# EAGLE design flexibleConnector (EAGLE 6.5.0)
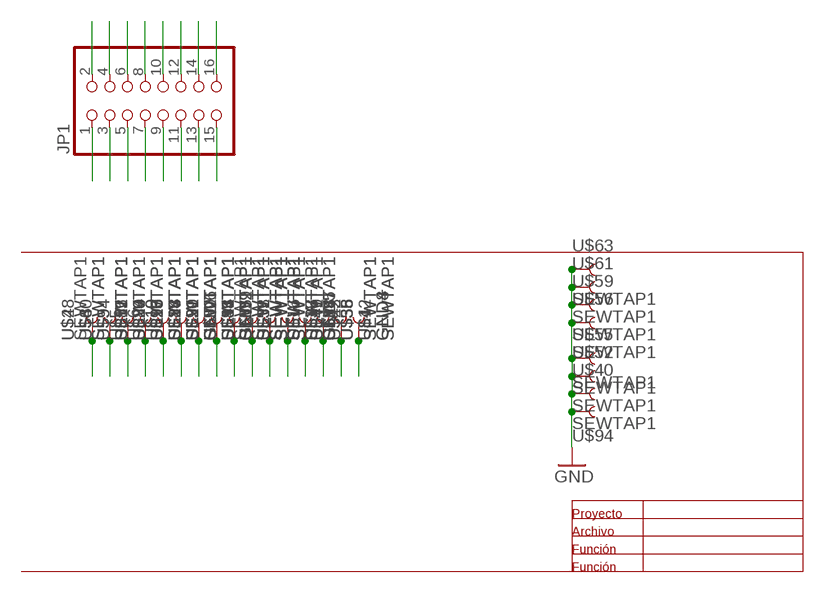
[diagram p0: schematic, sheet 1]

## Parts
GND1  SEWTAP1  [PETAL-LONG-1]
GND2  SEWTAP1  [PETAL-LONG-1]
GND4  SEWTAP1  [PETAL-LONG-1]
GND5  SEWTAP1  [PETAL-LONG-1]
GND6  SEWTAP1  [PETAL-LONG-1]
GND7  SEWTAP1  [PETAL-LONG-1]
GND8  SEWTAP1  [PETAL-LONG-1]
GND9  SEWTAP1  [PETAL-LONG-1]
JP1  PINHD-2X8  [2X08]
U$1  SEWTAP1  [PETAL-LONG-1]
U$2  SEWTAP1  [PETAL-LONG-1]
U$3  SEWTAP1  [PETAL-LONG-1]
U$4  SEWTAP1  [PETAL-LONG-1]
U$5  SEWTAP1  [PETAL-LONG-1]
U$6  SEWTAP1  [PETAL-LONG-1]
U$7  SEWTAP1  [PETAL-LONG-1]
U$8  SEWTAP1  [PETAL-LONG-1]
U$9  SEWTAP1  [PETAL-LONG-1]
U$10  SEWTAP1  [PETAL-LONG-1]
U$11  SEWTAP1  [PETAL-LONG-1]
U$12  SEWTAP1  [PETAL-LONG-1]
U$13  SEWTAP1  [PETAL-LONG-1]
U$14  SEWTAP1  [PETAL-LONG-1]
U$15  SEWTAP1  [PETAL-LONG-1]
U$16  SEWTAP1  [PETAL-LONG-1]
U$17  SEWTAP1  [PETAL-LONG-1]
U$18  SEWTAP1  [PETAL-LONG-1]
U$19  SEWTAP1  [PETAL-LONG-1]
U$20  SEWTAP1  [PETAL-LONG-1]
U$21  SEWTAP1  [PETAL-LONG-1]
U$22  SEWTAP1  [PETAL-LONG-1]
U$23  SEWTAP1  [PETAL-LONG-1]
U$24  SEWTAP1  [PETAL-LONG-1]
U$25  SEWTAP1  [PETAL-LONG-1]
U$26  SEWTAP1  [PETAL-LONG-1]
U$27  SEWTAP1  [PETAL-LONG-1]
U$28  SEWTAP1  [PETAL-LONG-1]
U$29  SEWTAP1  [PETAL-LONG-1]
U$30  SEWTAP1  [PETAL-LONG-1]
U$31  SEWTAP1  [PETAL-LONG-1]
U$32  SEWTAP1  [PETAL-LONG-1]
U$33  SEWTAP1  [PETAL-LONG-1]
U$34  SEWTAP1  [PETAL-LONG-1]
U$35  SEWTAP1  [PETAL-LONG-1]
U$36  SEWTAP1  [PETAL-LONG-1]
U$38  SEWTAP1  [PETAL-LONG-1]
U$40  SEWTAP1  [PETAL-LONG-1]
U$41  SEWTAP1  [PETAL-LONG-1]
U$42  SEWTAP1  [PETAL-LONG-1]
U$43  SEWTAP1  [PETAL-LONG-1]
U$44  SEWTAP1  [PETAL-LONG-1]
U$48  SEWTAP1  [PETAL-LONG-1]
U$49  SEWTAP1  [PETAL-LONG-1]
U$50  SEWTAP1  [PETAL-LONG-1]
U$52  SEWTAP1  [PETAL-LONG-1]
U$53  SEWTAP1  [PETAL-LONG-1]
U$54  SEWTAP1  [PETAL-LONG-1]
U$55  SEWTAP1  [PETAL-LONG-1]
U$56  SEWTAP1  [PETAL-LONG-1]
U$58  SEWTAP1  [PETAL-LONG-1]
U$59  SEWTAP1  [PETAL-LONG-1]
U$60  SEWTAP1  [PETAL-LONG-1]
U$61  SEWTAP1  [PETAL-LONG-1]
U$63  SEWTAP1  [PETAL-LONG-1]
U$65  SEWTAP1  [PETAL-LONG-1]
U$85  SEWTAP1  [PETAL-LONG-1]
U$88  SEWTAP1  [PETAL-LONG-1]
U$89  SEWTAP1  [PETAL-LONG-1]
U$90  SEWTAP1  [PETAL-LONG-1]
U$91  SEWTAP1  [PETAL-LONG-1]
U$92  SEWTAP1  [PETAL-LONG-1]
U$93  SEWTAP1  [PETAL-LONG-1]
U$94  SEWTAP1  [PETAL-LONG-1]

## Nets
1: GND4.1 GND8.1 JP1.1 U$22.1 U$43.1
2: JP1.2 U$1.1 U$41.1 U$42.1 U$49.1
3: JP1.3 U$35.1 U$36.1 U$38.1 U$58.1
4: GND5.1 GND7.1 JP1.4 U$18.1 U$34.1
5: JP1.5 U$17.1 U$32.1 U$33.1 U$53.1
6: GND2.1 GND9.1 JP1.6 U$16.1 U$65.1
7: JP1.7 U$15.1 U$31.1 U$44.1 U$93.1
8: GND1.1 GND6.1 JP1.8 U$50.1 U$92.1
9: JP1.9 U$21.1 U$29.1 U$30.1 U$91.1
10: JP1.10 U$14.1 U$27.1 U$28.1 U$88.1
11: JP1.11 U$13.1 U$25.1 U$26.1 U$90.1
12: JP1.12 U$20.1 U$23.1 U$24.1 U$89.1
13: JP1.13 U$7.1 U$11.1 U$12.1 U$85.1
14: JP1.14 U$9.1 U$10.1 U$19.1 U$54.1
15: JP1.15 U$4.1 U$6.1 U$8.1 U$60.1
16: JP1.16 U$2.1 U$3.1 U$5.1 U$48.1
GND: U$40.1 U$52.1 U$55.1 U$56.1 U$59.1 U$61.1 U$63.1 U$94.1

## Notes on the sheet
- Proyecto
- Archivo
- Función
- Función

## Library data of the parts
GND1 GND2 GND4-GND9 U$1-U$36 U$38 U$40-U$44 U$48-U$50 U$52-U$56 U$58-U$61 U$63 U$65 U$85 U$88-U$94 = LilyPad-Wearables:SEWTAP: Sew Taps for LilyPad Boards.
JP1 = pinhead+:PINHD-2X8: PIN HEADER

## Net classes
0 Default: width 0.203 mm
1 VCC: width 0.305 mm

## Board
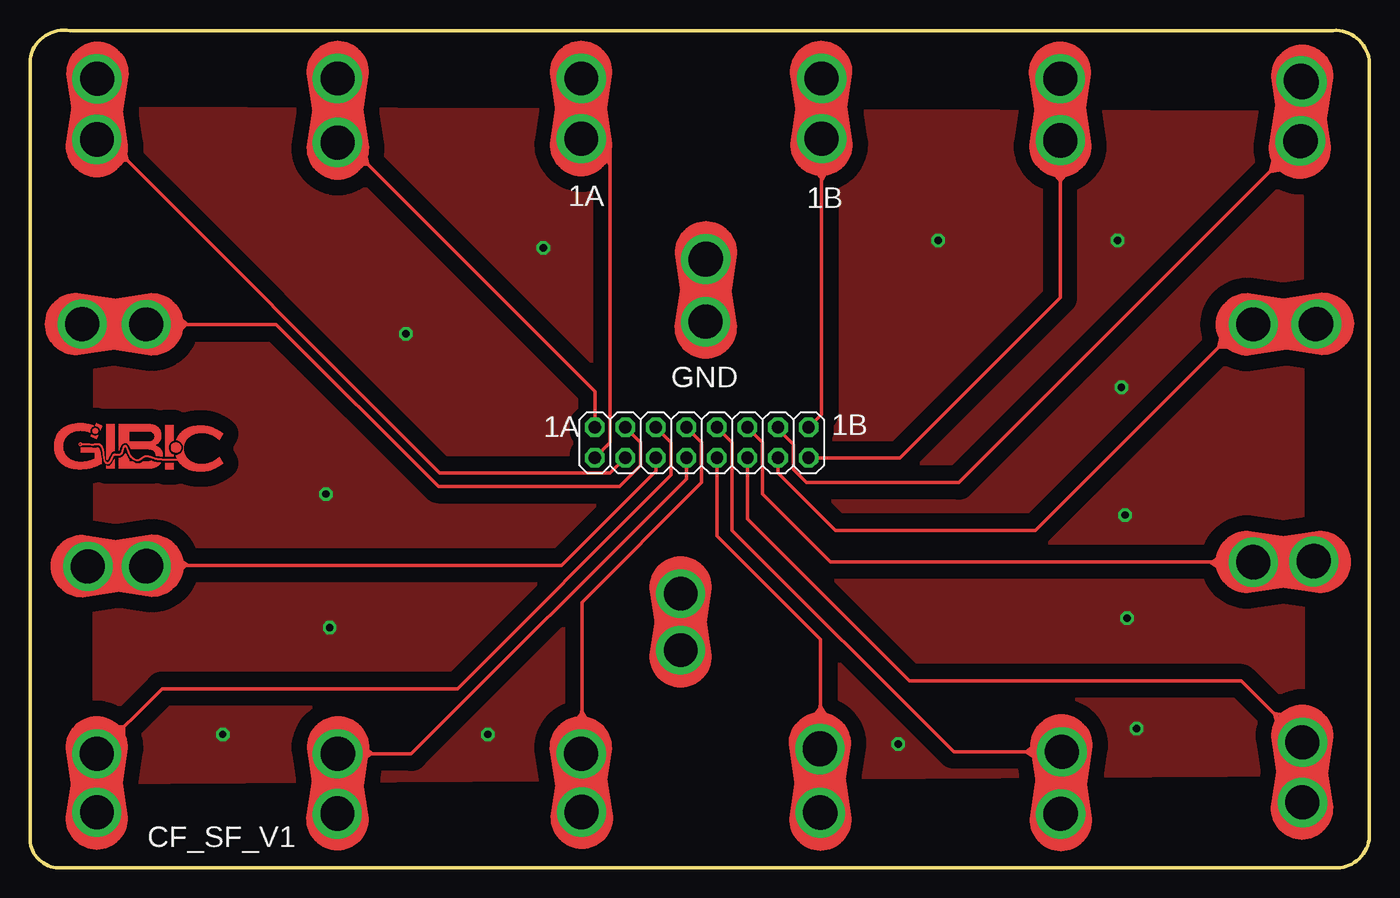
[diagram p1: board, top side]
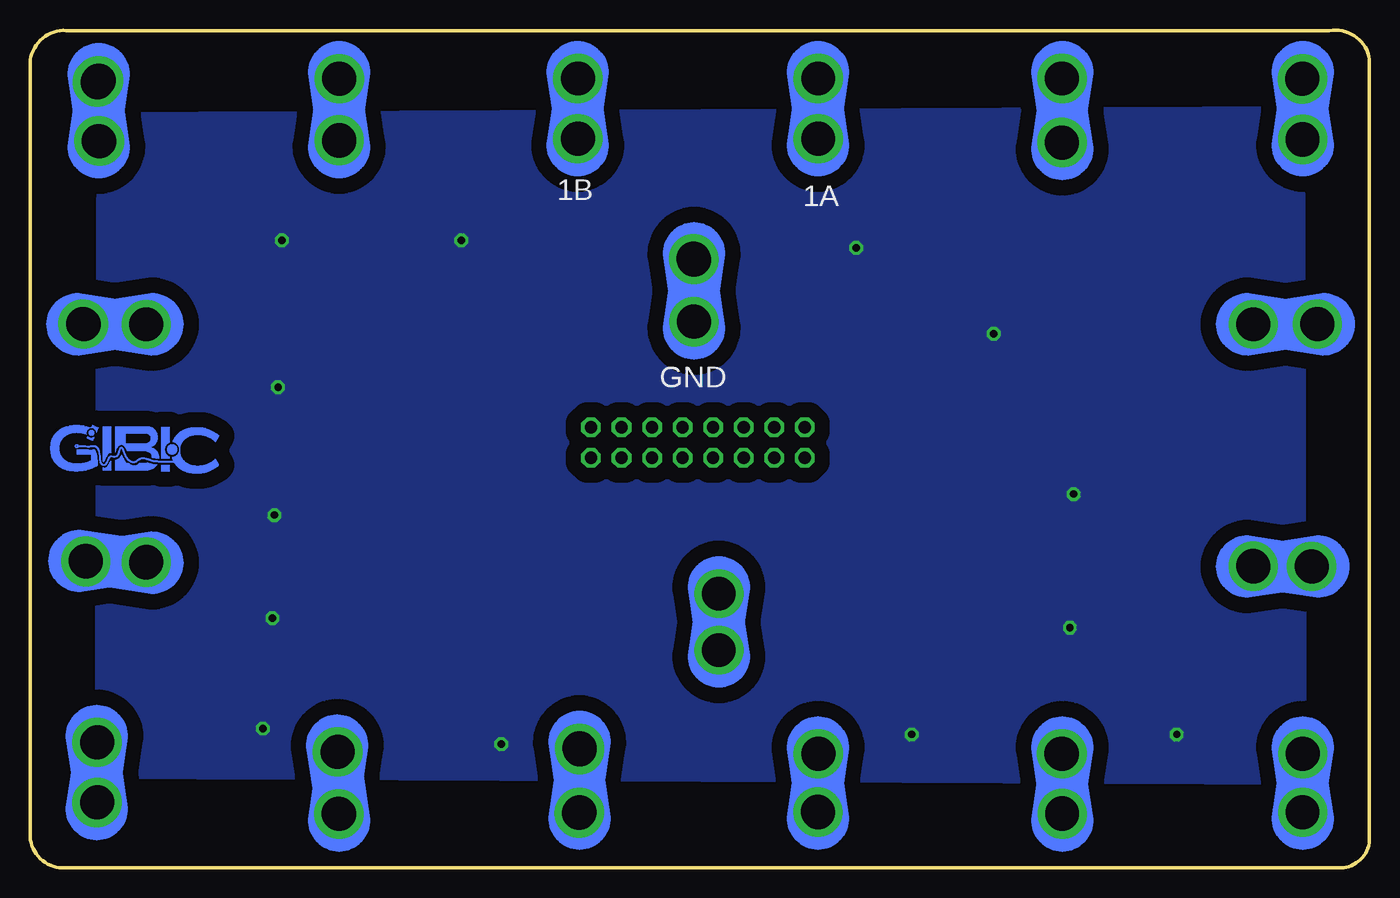
[diagram p2: board, bottom side, seen from below]

Size 111.44 x 69.73 mm. Coordinates in mm from the lower left corner, seen from the top.
Outline: 3.33,69.69 108.43,69.69 arc-90 111.44,66.99 111.44,2.86 arc-90 108.74,0 2.38,0 arc-90 0,2.54 0,67.31 arc-90 3.33,69.69
Copper layers (1*16): Top 0.35mm / dielectric 1.5mm / Bottom 0.35mm
Design rules "SparkFun *": minimum track width 8mil, minimum drill 20mil, track to track 8mil, track to pad 8mil, pad to pad 8mil, via to via 8mil, smd to smd 8mil, copper to edge 10mil, drill to drill 8mil, minimum pad ring 12mil, minimum via ring 10mil, stop-mask expansion 4mil, vias tented up to drill 20mil, thermal gap 20mil

### Footprints (pad centres in the part's own frame; a part is rotated, then mirrored left to right if it is on the bottom)
PETAL-LONG-1 = drill 2.794 pad 4.064: 1 0.03,0
2X08 = drill 1.016 octagon: 1 -8.89,-1.27; 2 -8.89,1.27; 3 -6.35,-1.27; 4 -6.35,1.27; 5 -3.81,-1.27; 6 -3.81,1.27; 7 -1.27,-1.27; 8 -1.27,1.27; 9 1.27,-1.27; 10 1.27,1.27; 11 3.81,-1.27; 12 3.81,1.27; 13 6.35,-1.27; 14 6.35,1.27; 15 8.89,-1.27; 16 8.89,1.27

### Placement (x,y rotation side)
GND1  45.82,9.55 270 top
GND2  5.56,9.53 270 bottom
GND4  45.85,60.66 90 top
GND5  4.31,45.27 0 top
GND6  45.88,9.53 270 bottom
GND7  4.29,45.24 180 bottom
GND8  45.88,65.72 270 bottom
GND9  5.56,4.6 90 bottom
JP1  55.88,35.4 0 top
U$1  25.6,65.74 270 top
U$2  65.88,65.72 270 bottom
U$3  65.88,60.64 90 bottom
U$4  85.73,60.48 90 bottom
U$5  65.82,65.74 270 top
U$6  85.7,65.69 270 top
U$7  101.74,45.24 0 top
U$8  85.73,65.72 270 bottom
U$9  105.73,60.48 90 bottom
U$10  105.73,65.56 270 bottom
U$11  107,45.24 0 bottom
U$12  101.76,45.24 180 bottom
U$13  105.85,10.5 270 top
U$14  85.82,9.7 270 top
U$15  25.63,9.55 270 top
U$16  5.55,9.54 270 top
U$17  9.71,25.16 180 top
U$18  9.69,45.24 180 top
U$19  105.84,65.42 270 top
U$20  101.74,25.47 0 top
U$21  65.71,9.87 270 top
U$22  45.85,65.74 270 top
U$23  106.84,25.56 0 bottom
U$24  101.76,25.4 180 bottom
U$25  105.89,5.4 90 bottom
U$26  105.89,10.48 270 bottom
U$27  85.73,4.45 90 bottom
U$28  85.88,9.68 270 bottom
U$29  65.72,10 270 bottom
U$30  65.72,4.6 90 bottom
U$31  25.56,4.45 90 bottom
U$32  4.76,25.08 180 bottom
U$33  9.68,25.08 0 bottom
U$34  9.68,45.24 0 bottom
U$35  5.56,65.72 270 bottom
U$36  5.56,60.64 90 bottom
U$38  5.61,65.68 270 top
U$40  56.24,50.74 270 top
U$41  25.56,65.72 270 bottom
U$42  25.56,60.33 90 bottom
U$43  45.88,60.64 90 bottom
U$44  25.56,9.53 270 bottom
U$48  65.85,60.68 90 top
U$49  25.61,60.36 90 top
U$50  45.88,4.6 90 bottom
U$52  56.2,50.64 270 bottom
U$53  4.79,25.12 0 top
U$54  105.66,60.43 90 top
U$55  56.2,45.4 90 bottom
U$56  54.13,22.86 270 top
U$58  5.56,60.57 90 top
U$59  54.13,18.1 90 top
U$60  85.72,60.57 90 top
U$61  54.13,18.1 90 bottom
U$63  54.13,22.86 270 bottom
U$65  5.56,4.61 90 top
U$85  107.08,45.28 180 top
U$88  85.77,4.48 90 top
U$89  106.82,25.47 180 top
U$90  105.83,5.44 90 top
U$91  65.76,4.53 90 top
U$92  45.91,4.66 90 top
U$93  25.57,4.54 90 top
U$94  56.22,45.45 90 top

### Tracks (layer width: path | path; a pad name or v marks a point on that pad's centre or on a via)
1
  Top 0.305: GND4.1 U$22.1 46.2,66.06 | GND4.1 | GND4.1 48.26,60.69 48.26,58.58 | 48.26,58.58 48.26,35.4 JP1.1 | 48.26,58.58 47.78,59.37
  Bottom 0.61: U$22.1 45.87,65.69 GND8.1 | U$43.1 45.87,60.69 GND4.1
2
  Top 0.305: U$1.1 25.56,65.76 | JP1.2 46.99,39.64 26.25,60.39 U$49.1
  Top 0.406: U$1.1 U$49.1
  Bottom 0.61: U$41.1 25.58,65.71 U$1.1 | U$49.1 25.58,60.35 U$42.1
3
  Top 0.305: U$38.1 5.24,66.01 | JP1.3 48.26,32.86 34.09,32.86 6.28,60.67 U$36.1
  Top 0.406: U$38.1 5.56,65.65 U$58.1
  Bottom 0.61: U$36.1 5.56,60.83 U$58.1 | U$35.1 U$38.1
4
  Top 0.305: JP1.4 50.8,35.4 50.8,33.5 49.05,31.75 33.97,31.75 20.48,45.24 U$18.1 9.63,45.27 GND5.1
  Bottom 0.61: GND7.1 GND5.1 | U$34.1 U$18.1
5
  Top 0.305: JP1.5 52.07,33.02 44.21,25.16 U$17.1 | U$53.1 9.64,25.12
  Top 0.406: U$17.1 9.64,25.12
  Top 0.61: U$53.1 U$32.1 | 9.64,25.12 9.65,25.1 U$33.1
6
  Top 0.305: JP1.6 53.34,35.4 53.34,32.7 35.56,14.92 10.98,14.92 GND2.1
  Top 0.406: U$16.1 GND2.1 U$65.1
  Top 0.61: GND2.1 U$16.1 | U$65.1 GND9.1
7
  Top 0.305: JP1.7 54.61,32.38 31.72,9.49 U$44.1
  Top 0.406: U$15.1 25.57,9.47 U$93.1
  Top 0.61: U$44.1 25.59,9.52 U$15.1 | U$93.1 25.56,4.55 U$31.1
8
  Top 0.305: JP1.8 55.88,35.4 55.88,32.07 45.91,22.1 45.91,8.89
  Top 0.406: GND1.1 45.91,9.43 45.91,8.89 U$92.1
  Top 0.61: GND1.1 45.85,9.49 GND6.1 | U$92.1 45.88,4.66 U$50.1
9
  Top 0.305: U$91.1 66.67,3.65 66.04,3.01 | JP1.9 57.15,27.62 65.76,19.01 65.76,9.79
  Top 0.406: U$21.1 65.76,9.79 65.76,9.21 U$91.1
  Top 0.61: U$21.1 65.72,9.86 U$29.1 | U$30.1 65.76,4.59 U$91.1
10
  Top 0.305: U$14.1 76.85,9.67 58.42,28.1 58.42,35.4 JP1.10
  Top 0.406: U$14.1 85.77,9.62 U$88.1
  Top 0.61: U$14.1 85.84,9.65 U$28.1 | U$27.1 U$88.1
11
  Top 0.305: U$90.1 105.89,5.41 | JP1.11 59.69,29.05 73.18,15.56 100.78,15.56 U$26.1
  Top 0.406: U$13.1 105.83,10.45 U$90.1
  Top 0.61: U$13.1 106.2,10.11 106.2,9.84 105.89,10.16 U$26.1 | 105.89,5.41 U$25.1
12
  Top 0.305: U$20.1 66.61,25.47 60.96,31.11 60.96,35.4 JP1.12
  Top 0.406: U$20.1 U$89.1
  Top 0.61: U$20.1 101.79,25.46 U$24.1 | U$23.1 106.79,25.54 U$89.1
13
  Top 0.305: U$7.1 100.8,45.24 98.9,43.34 | 98.9,43.34 83.66,28.1 66.99,28.1 62.23,32.86 JP1.13 | 98.9,43.34 99.06,44.13 | 98.9,43.34 99.7,43.34
  Top 0.406: U$7.1 101.81,45.28 U$85.1
  Bottom 0.61: U$12.1 U$7.1 | U$85.1 106.77,45.24 U$11.1
14
  Top 0.305: JP1.14 62.23,36.51 63.5,35.24 63.5,33.18 64.61,32.07 77.28,32.07 U$9.1
  Top 0.406: U$19.1 105.66,65.05 U$54.1
  Bottom 0.61: U$19.1 105.7,65.06 U$10.1 | U$54.1 U$9.1
15
  Top 0.305: JP1.15 72.39,34.13 85.72,47.46 85.72,61.12
  Top 0.406: U$6.1 85.72,65.64 85.72,61.12 U$60.1
  Bottom 0.61: U$8.1 U$6.1 | U$60.1 U$4.1
16
  Top 0.305: U$48.1 65.85,37.75 JP1.16
  Top 0.406: U$5.1 65.85,65.37 U$48.1
  Bottom 0.61: U$2.1 65.86,65.39 U$5.1 | U$48.1 U$3.1
GND  (via drill 0.61)
  Top 0.305: U$40.1 56.22,48.78 U$94.1 | U$59.1 U$56.1
  Top 0.406: U$94.1 54.87,46.83
  Bottom 0.406: U$52.1 56.22,48.71 U$94.1
  other vias: 24.92,20 24.61,31.12 31.27,44.45 42.7,51.59 75.57,52.23 90.49,52.23 90.81,40.01 91.12,29.37 91.28,20.8 92.08,11.59 72.23,10.32 38.1,11.11 16.03,11.11
  pour Top (isolate 1.27): 5.56,63.18 105.73,62.86 105.89,7.78 5.4,7.14
  pour Bottom (isolate 1.27): 5.56,63.18 105.73,62.71 105.89,7.62 5.4,7.14
N$2
  Top 0.305: 8.1,58.9 7.94,59.53 7.46,58.9 8.1,58.9
N$3
  Top 0.305: 27.94,59.37 28.1,58.58 27.46,58.58
N$4
  Top 0.305: 65.88,57.31 66.36,58.1 65.25,58.1 65.88,57.31
N$5
  Top 0.305: 103.51,59.21 103.19,57.94 104.14,58.1 103.35,58.26 103.51,59.05
N$6
  Top 0.305: 99.38,43.66 99.38,43.5
N$7
  Top 0.305: 98.9,25.88 98.27,25.4 99.22,24.76
N$8
  Top 0.305: 104.46,12.7 103.51,12.86 103.82,11.91
N$9
  Top 0.305: 83.5,10.16 82.87,9.68 83.5,9.21
N$10
  Top 0.305: 65.72,13.33 65.25,12.7
N$11
  Top 0.305: 65.72,13.49 66.2,12.7
N$12
  Top 0.305: 45.88,12.86 45.4,12.22
N$13
  Top 0.305: 45.88,13.02 46.35,12.22
N$14
  Top 0.305: 28.1,9.84 28.42,9.52 27.78,9.05
N$15
  Top 0.305: 6.99,11.75 7.78,11.75 7.78,10.79
N$16
  Top 0.305: 12.38,25.72 13.02,25.24 12.54,24.76
N$17
  Top 0.305: 13.02,45.24 12.54,45.72 12.54,44.77 13.02,45.24
N$18
  Top 0.305: 85.73,57.15 86.52,58.1 84.93,58.1 85.73,57.15
(copper drawn outside any net)
  shapes: Bottom area x1295, Top area x1295

### Text on the board
tPlace: 1A | 1B | GND | 1A | 1B | CF_SF_V1
bPlace: 1A | 1B | GND